# Altium schematic sheet nguon12.SchDoc
size A
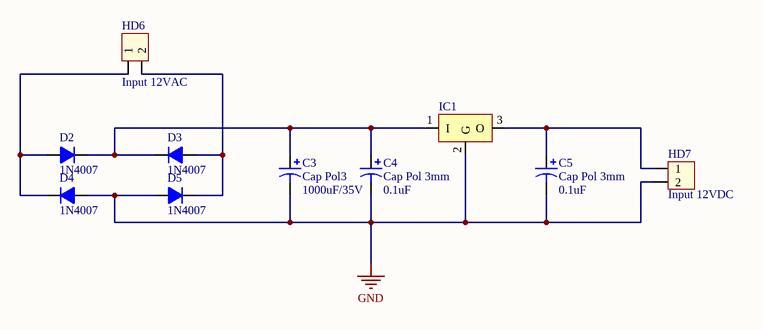
[diagram p0: nguon12.SchDoc]

## Parts
C3  Cap Pol3  value 1000uF/35V  [CP2/5]
C4  Cap Pol 3mm  [C3MM]
C5  Cap Pol 3mm  [C3MM]
D2  1N4007  [D2A]
D3  1N4007  [D2A]
D4  1N4007  [D2A]
D5  1N4007  [D2A]
HD6  Input 12VAC  [HED2]
HD7  Input 12VDC  [HED2]
IC1  LM78xx  [TO220-123]  (value not drawn)

## Nets
GND: C3.2 C4.2 C5.2 D4.1(A) D5.1(A) HD7.2 IC1.2(G)
NetC3_1: C3.1 C4.1 D2.2(K) D3.2(K) IC1.1(I)
NetC5_1: C5.1 HD7.1 IC1.3(O)
NetD2_1: D2.1(A) D4.2(K) HD6.1
NetD3_1: D3.1(A) D5.2(K) HD6.2

## Notes on the sheet
- (in symbol Cap Pol 3mm) 0.1uF

## Library data of the parts
C3 = Cap Pol3: Polarized Capacitor (Surface Mount); VALUE: C?; LatestRevisionDate: 17-Jul-2002; LatestRevisionNote: Re-released for DXP Platform.; PackageReference: C0805; Publisher: Altium Limited
C4 C5 = Cap Pol 3mm: Polarized Capacitor (Axial); Published: 8-Jun-2000; LatestRevisionDate: 17-Jul-2002; LatestRevisionNote: Re-released for DXP Platform.; PackageReference: POLAR0.8; Publisher: Altium Limited
D2-D5 = D1A: Diode 1A; Value: 1N4007
HD6 HD7 = Hed2: Header 2 (Green); Value: Header 2
IC1 = LM78xx: Positive Voltage Regulator; Note: Tab is connected to pin 3 (GND).; Published: 24-Aug-2001; LatestRevisionDate: 17-Jul-2002; LatestRevisionNote: Re-released for DXP Platform.; DatasheetVersion: Apr-1994; PackageVersion: Jul-1998; PackageReference: ISOWATT220AB; Publisher: Altium Limited; PackageDescription: TO, Thru-Hole, Vertical, Heatsink Mounted; 3 In-Line Leads; Pitch 2.54 mm; Pin sequence 1, 3, 2; ComponentLink1Description: Manufacturer Link; ComponentLink1URL: http://www.st.com/; ComponentLink2Description: Datasheet; ComponentLink2URL: http://www.st.com/stonline/products/literature/ds/2146/l78m05c.pdf